# Altium project 考勤机主板3.0（改）.PrjPcb
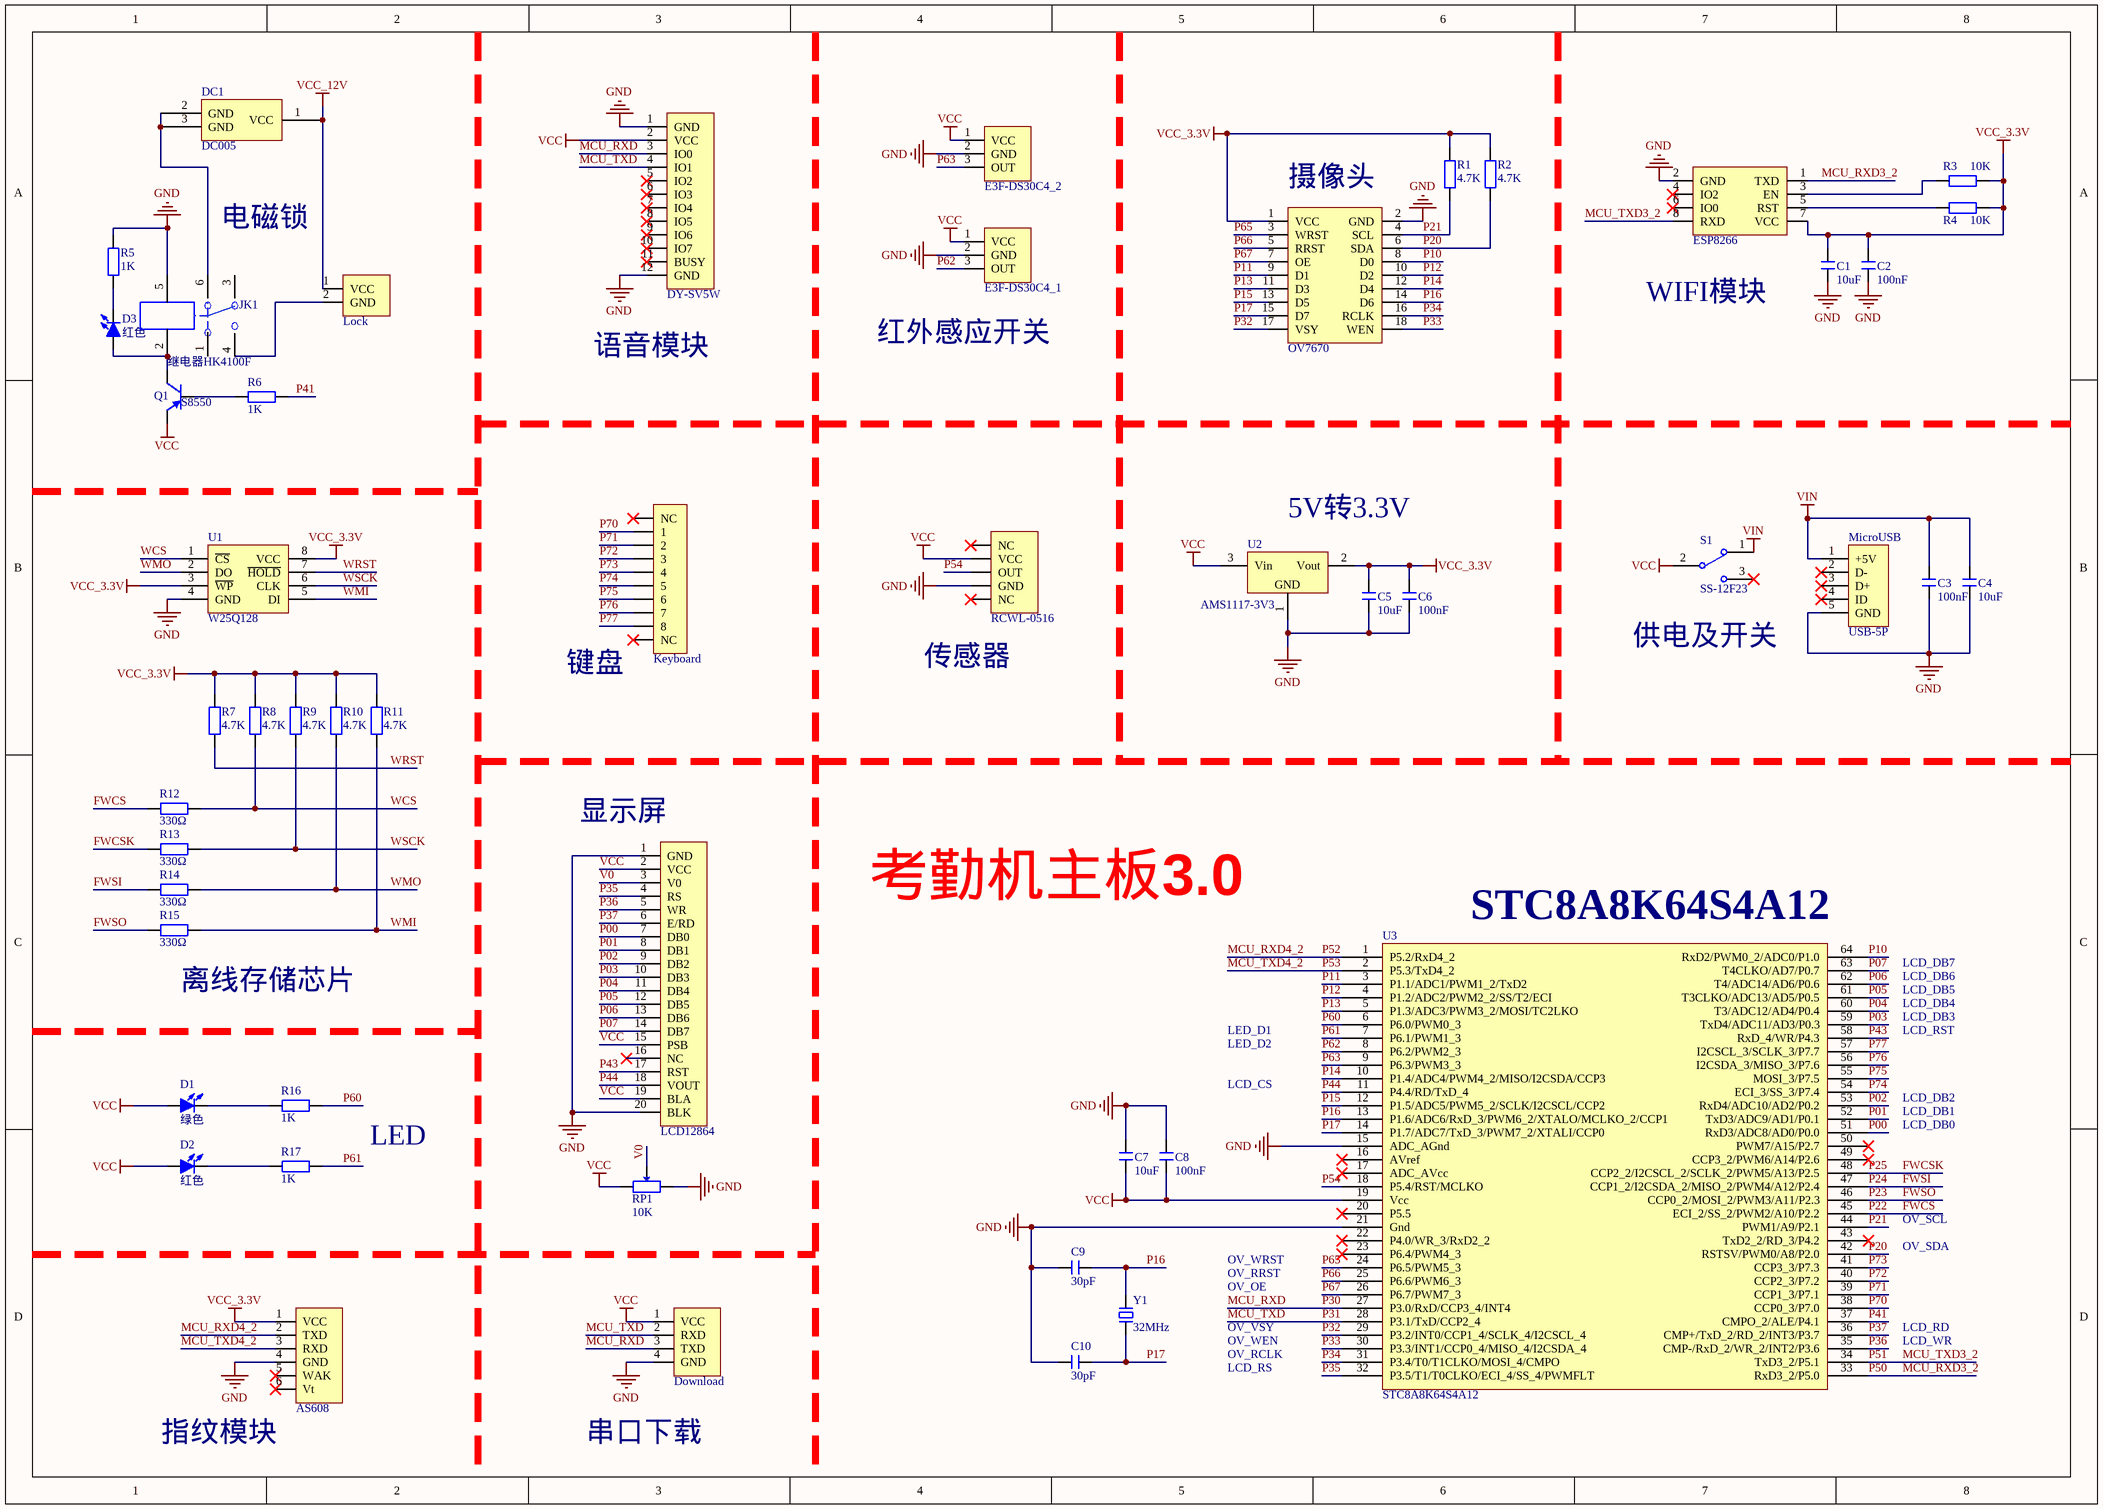
[diagram p0: 考勤机主板3.0.SchDoc]
1 sheet, 51 parts. Net scope: global (net labels, ports and power ports of the same name join across sheets).
Board file: 考勤机主板3.0（改）.PcbDoc

## Sheet 考勤机主板3.0.SchDoc
size A3

### Parts
AS608  HDR-1X6  [HDR2.54-LI-6P]  (value not drawn)
C1  10uF  [C 0805_M]
C2  100nF  [C 0805_M]
C3  100nF  [C 0805_M]
C4  10uF  [C 0805_M]
C5  10uF  [C 0805_M]
C6  100nF  [C 0805_M]
C7  10uF  [C 0805_M]
C8  100nF  [C 0805_M]
C9  30pF  [C 0805_M]
C10  30pF  [C 0805_M]
D1  绿色  [LED 0805G]
D2  红色  [LED 0805R]
D3  红色  [LED 0805G]
DC1  DC005  [DC-005]
Download  HDR-1X4  [HDR2.54-LI-4P]  (value not drawn)
DY-SV5W  HDR-1X12  [HDR2.54-M-LI-12P]  (value not drawn)
E3F-DS30C4_1  HDR-1X3  [HDR2.54-M-LI-3P]  (value not drawn)
E3F-DS30C4_2  HDR-1X3  [HDR2.54-M-LI-3P]  (value not drawn)
ESP8266  Header 4X2  [HDR2.54-LI-2x4P]  (value not drawn)
JK1  继电器HK4100F  [HK4100F - duplicate]
Keyboard  HDR-1X10  [HDR2.54-M-LI-10P]  (value not drawn)
LCD12864  HDR-1X20  [HDR2.54-M-LI-20P]  (value not drawn)
Lock  HDR-1X2  [XH2.54-WI-2P]  (value not drawn)
MicroUSB  USB-5P  [USB]
OV7670  Header 9X2  [HDR2.54-LI-2x9P]  (value not drawn)
Q1  S8550  [SOT23-3M]
R1  4.7K  [R 0805_M]
R2  4.7K  [R 0805_M]
R3  10K  [R 0805_M]
R4  10K  [R 0805_M]
R5  1K  [R 0805_M]
R6  1K  [R 0805_M]
R7  4.7K  [R 0805_M]
R8  4.7K  [R 0805_M]
R9  4.7K  [R 0805_M]
R10  4.7K  [R 0805_M]
R11  4.7K  [R 0805_M]
R12  330Ω  [R 0805_M]
R13  330Ω  [R 0805_M]
R14  330Ω  [R 0805_M]
R15  330Ω  [R 0805_M]
R16  1K  [R 0805_M]
R17  1K  [R 0805_M]
RCWL-0516  HDR-1X5  [HDR2.54-M-LI-5P]  (value not drawn)
RP1  10K  [RM065]
S1  SS-12F23  [SS-12F23]
U1  W25Q128  [SOP8W_M]
U2  AMS1117-3V3  [SOT-223]
U3  STC8A8K64S4A12  [LQFP-64]
Y1  32MHz  [HC-49S]

### Nets
GND: AS608.4(GND) C1.1 C2.1 C3.1 C4.1 C5.1 C6.1 C7.2 C8.2 C9.1 C10.1 Download.4(GND) DY-SV5W.1(GND) DY-SV5W.12(GND) E3F-DS30C4_1.2(GND) E3F-DS30C4_2.2(GND) ESP8266.2(GND) JK1.5 LCD12864.1(GND) LCD12864.20(BLK) MicroUSB.5(GND) OV7670.2(GND) R5.2 RCWL-0516.4(GND) RP1.3 U1.4(GND) U2.1(GND) U3.15(ADC_AGnd) U3.21(Gnd)
VCC: C7.1 C8.1 D1.1(A) D2.1(A) Download.1(VCC) DY-SV5W.2(VCC) E3F-DS30C4_1.1(VCC) E3F-DS30C4_2.1(VCC) LCD12864.2(VCC) LCD12864.15(PSB) LCD12864.19(BLA) Q1.2(E) RCWL-0516.2(VCC) RP1.1 S1.2 U2.3(Vin) U3.19(Vcc)
VCC_3.3V: AS608.1(VCC) C1.2 C2.2 C5.2 C6.2 ESP8266.7(VCC) OV7670.1(VCC) R1.2 R2.2 R3.2 R4.2 R7.2 R8.2 R9.2 R10.2 R11.2 U1.3(~{WP}) U1.8(VCC) U2.2(Vout)
VCC_12V: DC1.1(VCC) Lock.1(VCC)
VIN: C3.2 C4.2 MicroUSB.1(+5V) S1.1
FWCS: R12.1 U3.45(ECI_2/SS_2/PWM2/A10/P2.2)  [also labelled P22]
FWCSK: R13.1 U3.48(CCP2_2/I2CSCL_2/SCLK_2/PWM5/A13/P2.5)  [also labelled P25]
FWSI: R14.1 U3.47(CCP1_2/I2CSDA_2/MISO_2/PWM4/A12/P2.4)  [also labelled P24]
FWSO: R15.1 U3.46(CCP0_2/MOSI_2/PWM3/A11/P2.3)  [also labelled P23]
MCU_RXD: Download.3(TXD) DY-SV5W.3(IO0) U3.27(P3.0/RxD/CCP3_4/INT4)  [also labelled P30]
MCU_RXD3_2: ESP8266.1(TXD) U3.33(RxD3_2/P5.0)  [also labelled P50]
MCU_RXD4_2: AS608.2(TXD) U3.1(P5.2/RxD4_2)  [also labelled P52]
MCU_TXD: Download.2(RXD) DY-SV5W.4(IO1) U3.28(P3.1/TxD/CCP2_4)  [also labelled P31]
MCU_TXD3_2: ESP8266.8(RXD) U3.34(TxD3_2/P5.1)  [also labelled P51]
MCU_TXD4_2: AS608.3(RXD) U3.2(P5.3/TxD4_2)  [also labelled P53]
P00: LCD12864.7(DB0) U3.51(RxD3/ADC8/AD0/P0.0)
P01: LCD12864.8(DB1) U3.52(TxD3/ADC9/AD1/P0.1)
P02: LCD12864.9(DB2) U3.53(RxD4/ADC10/AD2/P0.2)
P03: LCD12864.10(DB3) U3.59(TxD4/ADC11/AD3/P0.3)
P04: LCD12864.11(DB4) U3.60(T3/ADC12/AD4/P0.4)
P05: LCD12864.12(DB5) U3.61(T3CLKO/ADC13/AD5/P0.5)
P06: LCD12864.13(DB6) U3.62(T4/ADC14/AD6/P0.6)
P07: LCD12864.14(DB7) U3.63(T4CLKO/AD7/P0.7)
P10: OV7670.8(D0) U3.64(RxD2/PWM0_2/ADC0/P1.0)
P11: OV7670.9(D1) U3.3(P1.1/ADC1/PWM1_2/TxD2)
P12: OV7670.10(D2) U3.4(P1.2/ADC2/PWM2_2/SS/T2/ECI)
P13: OV7670.11(D3) U3.5(P1.3/ADC3/PWM3_2/MOSI/TC2LKO)
P14: OV7670.12(D4) U3.10(P1.4/ADC4/PWM4_2/MISO/I2CSDA/CCP3)
P15: OV7670.13(D5) U3.12(P1.5/ADC5/PWM5_2/SCLK/I2CSCL/CCP2)
P16: C9.2 OV7670.14(D6) U3.13(P1.6/ADC6/RxD_3/PWM6_2/XTALO/MCLKO_2/CCP1) Y1.2
P17: C10.2 OV7670.15(D7) U3.14(P1.7/ADC7/TxD_3/PWM7_2/XTALI/CCP0) Y1.1
P20: OV7670.6(SDA) R2.1 U3.42(RSTSV/PWM0/A8/P2.0)
P21: OV7670.4(SCL) R1.1 U3.44(PWM1/A9/P2.1)
P32: OV7670.17(VSY) U3.29(P3.2/INT0/CCP1_4/SCLK_4/I2CSCL_4)
P33: OV7670.18(WEN) U3.30(P3.3/INT1/CCP0_4/MISO_4/I2CSDA_4)
P34: OV7670.16(RCLK) U3.31(P3.4/T0/T1CLKO/MOSI_4/CMPO)
P35: LCD12864.4(RS) U3.32(P3.5/T1/T0CLKO/ECI_4/SS_4/PWMFLT)
P36: LCD12864.5(WR) U3.35(CMP-/RxD_2/WR_2/INT2/P3.6)
P37: LCD12864.6(E/RD) U3.36(CMP+/TxD_2/RD_2/INT3/P3.7)
P41: R6.2 U3.37(CMPO_2/ALE/P4.1)
P43: LCD12864.17(RST) U3.58(RxD_4/WR/P4.3)
P44: LCD12864.18(VOUT) U3.11(P4.4/RD/TxD_4)
P54: RCWL-0516.3(OUT) U3.18(P5.4/RST/MCLKO)
P60: R16.2 U3.6(P6.0/PWM0_3)
P61: R17.2 U3.7(P6.1/PWM1_3)
P62: E3F-DS30C4_1.3(OUT) U3.8(P6.2/PWM2_3)
P63: E3F-DS30C4_2.3(OUT) U3.9(P6.3/PWM3_3)
P65: OV7670.3(WRST) U3.24(P6.5/PWM5_3)
P66: OV7670.5(RRST) U3.25(P6.6/PWM6_3)
P67: OV7670.7(OE) U3.26(P6.7/PWM7_3)
P70: Keyboard.2(1) U3.38(CCP0_3/P7.0)
P71: Keyboard.3(2) U3.39(CCP1_3/P7.1)
P72: Keyboard.4(3) U3.40(CCP2_3/P7.2)
P73: Keyboard.5(4) U3.41(CCP3_3/P7.3)
P74: Keyboard.6(5) U3.54(ECI_3/SS_3/P7.4)
P75: Keyboard.7(6) U3.55(MOSI_3/P7.5)
P76: Keyboard.8(7) U3.56(I2CSDA_3/MISO_3/P7.6)
P77: Keyboard.9(8) U3.57(I2CSCL_3/SCLK_3/P7.7)
V0: LCD12864.3(V0) RP1.2
WCS: R8.1 R12.2 U1.1(~{CS})
WMI: R11.1 R15.2 U1.5(DI)
WMO: R10.1 R14.2 U1.2(DO)
WRST: R7.1 U1.7(~{HOLD})
WSCK: R9.1 R13.2 U1.6(CLK)
NetD1_2: D1.2(K) R16.1
NetD2_2: D2.2(K) R17.1
NetD3_1: D3.1(A) JK1.2 Q1.3(C)
NetD3_2: D3.2(K) R5.1
NetDC1_2: DC1.2(GND) DC1.3(GND) JK1.6
NetESP8266_3: ESP8266.3(EN) R3.1
NetESP8266_5: ESP8266.5(RST) R4.1
NetJK1_4: JK1.4 Lock.2(GND)
NetQ1_1: Q1.1(B) R6.1

Not connected (* = marked no-connect by the designer): AS608 5(WAK)* 6(Vt)*; DY-SV5W 5(IO2)* 6(IO3)* 7(IO4)* 8(IO5)* 9(IO6)* 10(IO7)* 11(BUSY)*; ESP8266 4(IO2)* 6(IO0)*; JK1 1 3; Keyboard 1(NC)* 10(NC)*; LCD12864 16(NC)*; MicroUSB 2(D-)* 3(D+)* 4(ID)*; RCWL-0516 1(NC)* 5(NC)*; S1 3*; U3 16(AVref)* 17(ADC_AVcc)* 20(P5.5)* 22(P4.0/WR_3/RxD2_2)* 23(P6.4/PWM4_3)* 43(TxD2_2/RD_3/P4.2)* 49(CCP3_2/PWM6/A14/P2.6)* 50(PWM7/A15/P2.7)*

### Notes on the sheet
- 电磁锁
- (near OV7670) 摄像头
- WIFI模块
- 语音模块
- (near E3F-DS30C4_1) 红外感应开关
- (near U2) 5V转3.3V
- (near S1) 供电及开关
- 键盘
- (near RCWL-0516) 传感器
- (near LCD12864) 显示屏
- 考勤机主板3.0
- (near R15) 离线存储芯片
- (near U3) STC8A8K64S4A12
- LCD_DB5
- LCD_DB6
- LCD_DB7
- LED_D1
- LED_D2
- LCD_DB3
- LCD_DB4
- LCD_RST
- LCD_CS
- LCD_DB0
- LCD_DB1
- LCD_DB2
- LED
- OV_WRST
- OV_SCL
- OV_SDA
- OV_RRST
- OV_OE
- OV_VSY
- OV_WEN
- OV_RCLK
- LCD_RS
- LCD_RD
- LCD_WR
- 指纹模块
- 串口下载

### Library data of the parts
AS608 = 指纹模块: AS608; BOM名称: 6P接插件; 版权归属: 源创客; 学习资源: www.ooocke.com
C1-C10 = C: 无极性贴片电容; 版权归属: 源创客; BOM名称: 无极性贴片电容; 学习资源: www.ooocke.com
D1-D3 = LED-SMD: 贴片LED; 版权归属: 源创客; BOM名称: 贴片LED; 学习资源: www.ooocke.com
Download = 串口下载: BOM名称: 4P接插件; 版权归属: 源创客; 学习资源: www.ooocke.com
DY-SV5W = 语音模块: DY-SV5W; BOM名称: 12P接插件; 版权归属: 源创客; 学习资源: www.ooocke.com
E3F-DS30C4_1 E3F-DS30C4_2 = 红外感应开关: E3F-DS30C4; BOM名称: 3P接插件; 版权归属: 源创客; 学习资源: www.ooocke.com
ESP8266 = WIFI模块: ESP8266-01; BOM名称: 4*2P接插件; 版权归属: 源创客; 学习资源: www.ooocke.com
Keyboard = 键盘: Keyboard; BOM名称: 10P接插件; 版权归属: 源创客; 学习资源: www.ooocke.com
LCD12864 = 显示屏: LCD12864; BOM名称: 20P接插件; 版权归属: 源创客; 学习资源: www.ooocke.com
Lock = 电磁锁: BOM名称: 2P接插件; 版权归属: 源创客; 学习资源: www.ooocke.com
MicroUSB = MiceoUSB接口: MicroUSB; BOM名称: 微型USB母座; 版权归属: 源创客; 学习资源: www.ooocke.com
OV7670 = 摄像头: OV7670; BOM名称: 9*2P接插件; 版权归属: 源创客; 学习资源: www.ooocke.com
Q1 = 8550-SMD: 高频放大-PNP型; 版权归属: 源创客; 属性: 40V 1.5A 1W 100MHZ; BOM名称: 高频放大-PNP型; 学习资源: www.ooocke.com
R1-R17 = R: 贴片电阻; 版权归属: 源创客; BOM名称: 贴片电阻; 学习资源: www.ooocke.com
RCWL-0516 = 传感器: RCWL-0516; BOM名称: 5P接插件; 版权归属: 源创客; 学习资源: www.ooocke.com
RP1 = RP-ID: 插件单联电位器; BOM名称: 插件电位器; 版权归属: 源创客; 学习资源: www.ooocke.com
S1 = SSW-1P: 1路波动开关; BOM名称: 波动开关; 版权归属: 源创客; 学习资源: www.ooocke.com
U1 = W25Q128: 离线存储芯片; BOM名称: 外置Flash; 版权归属: 源创客; 学习资源: www.ooocke.com
U2 = AMS1117: 三端稳压芯片; BOM名称: 稳压芯片; 版权归属: 源创客; 学习资源: www.ooocke.com
U3 = STC8A8K64S4A12: IC
Y1 = XTAL-2P: 2脚无源脚晶振; 版权归属: 源创客; BOM名称: 2脚无源脚晶振; 学习资源: www.ooocke.com